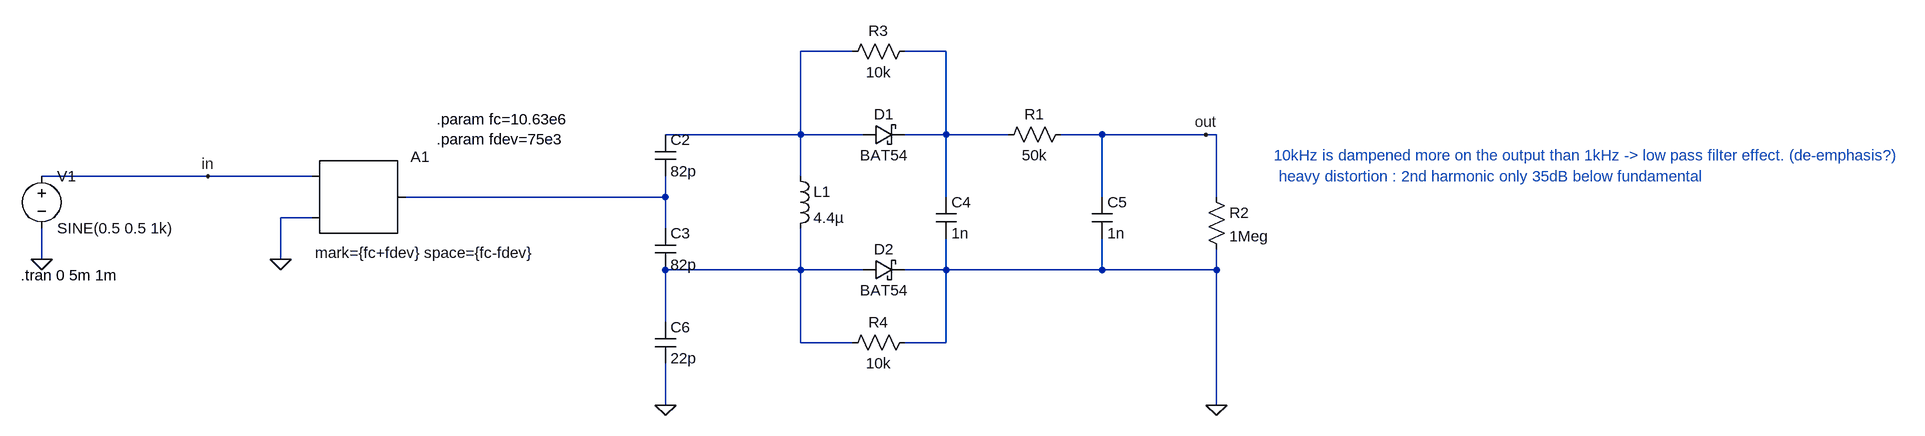
[diagram p0: schematic Weiss_discriminator_2011.asc]
Weiss_discriminator_2011.asc, the LTspice schematic file:
Version 4
SHEET 1 2636 680
WIRE 928 -96 848 -96
WIRE 1072 -96 1008 -96
WIRE 848 32 848 -96
WIRE 848 32 640 32
WIRE 944 32 848 32
WIRE 1072 32 1072 -96
WIRE 1072 32 1008 32
WIRE 1168 32 1072 32
WIRE 1312 32 1248 32
WIRE 1472 32 1312 32
WIRE 1488 32 1472 32
WIRE -64 96 -320 96
WIRE 96 96 -64 96
WIRE 848 96 848 32
WIRE 640 128 640 96
WIRE 640 128 240 128
WIRE 1072 128 1072 32
WIRE 1312 128 1312 32
WIRE 1488 128 1488 32
WIRE 96 160 48 160
WIRE 640 176 640 128
WIRE -320 224 -320 176
WIRE 48 224 48 160
WIRE 848 240 848 176
WIRE 848 240 640 240
WIRE 944 240 848 240
WIRE 1072 240 1072 192
WIRE 1072 240 1008 240
WIRE 1312 240 1312 192
WIRE 1312 240 1072 240
WIRE 1488 240 1488 208
WIRE 1488 240 1312 240
WIRE 640 320 640 240
WIRE 848 352 848 240
WIRE 928 352 848 352
WIRE 1072 352 1072 240
WIRE 1072 352 1008 352
WIRE 640 448 640 384
WIRE 1488 448 1488 240
FLAG 48 224 0
FLAG -320 224 0
FLAG 640 448 0
FLAG 1488 448 0
FLAG 1472 32 out
FLAG -64 96 in
SYMBOL SpecialFunctions\\modulate 96 96 R0
WINDOW 3 5 118 Left 2
SYMATTR Value mark={fc+fdev} space={fc-fdev}
SYMATTR InstName A1
SYMBOL voltage -320 80 R0
WINDOW 123 0 0 Left 0
WINDOW 39 0 0 Left 0
SYMATTR InstName V1
SYMATTR Value SINE(0.5 0.5 1k)
SYMBOL ind 832 80 R0
SYMATTR InstName L1
SYMATTR Value 4.4µ
SYMBOL cap 624 32 R0
SYMATTR InstName C2
SYMATTR Value 82p
SYMBOL cap 624 176 R0
SYMATTR InstName C3
SYMATTR Value 82p
SYMBOL schottky 944 48 R270
WINDOW 0 32 32 VTop 2
WINDOW 3 0 32 VBottom 2
SYMATTR InstName D1
SYMATTR Value BAT54
SYMATTR Description Diode
SYMATTR Type diode
SYMBOL schottky 944 256 R270
WINDOW 0 32 32 VTop 2
WINDOW 3 0 32 VBottom 2
SYMATTR InstName D2
SYMATTR Value BAT54
SYMATTR Description Diode
SYMATTR Type diode
SYMBOL cap 1056 128 R0
SYMATTR InstName C4
SYMATTR Value 1n
SYMBOL res 1264 16 R90
WINDOW 0 0 56 VBottom 2
WINDOW 3 32 56 VTop 2
SYMATTR InstName R1
SYMATTR Value 50k
SYMBOL cap 1296 128 R0
SYMATTR InstName C5
SYMATTR Value 1n
SYMBOL res 1472 112 R0
SYMATTR InstName R2
SYMATTR Value 1Meg
SYMBOL cap 624 320 R0
SYMATTR InstName C6
SYMATTR Value 22p
SYMBOL res 1024 -112 R90
WINDOW 0 0 56 VBottom 2
WINDOW 3 32 56 VTop 2
SYMATTR InstName R3
SYMATTR Value 10k
SYMBOL res 1024 336 R90
WINDOW 0 0 56 VBottom 2
WINDOW 3 32 56 VTop 2
SYMATTR InstName R4
SYMATTR Value 10k
TEXT -352 248 Left 2 !.tran 0 5m 1m
TEXT 288 8 Left 2 !.param fc=10.63e6\n.param fdev=75e3
TEXT 1576 64 Left 2 ;10kHz is dampened more on the output than 1kHz -> low pass filter effect. (de-emphasis?)
TEXT 1584 96 Left 2 ;heavy distortion : 2nd harmonic only 35dB below fundamental

The netlist it stands for:
* Weiss_discriminator_2011.asc
A1 in 0 0 0 0 0 N003 0 MODULATOR mark={fc+fdev} space={fc-fdev}
V1 in 0 SINE(0.5 0.5 1k)
L1 N001 N004 4.4µ
C2 N001 N003 82p
C3 N003 N004 82p
D1 N001 N002 BAT54
D2 N004 0 BAT54
C4 N002 0 1n
R1 out N002 50k
C5 out 0 1n
R2 out 0 1Meg
C6 N004 0 22p
R3 N002 N001 10k
R4 0 N004 10k
.model D D
.lib standard.dio
.tran 0 5m 1m
.param fc=10.63e6
.param fdev=75e3
* 10kHz is dampened more on the output than 1kHz -> low pass filter effect. (de-emphasis?)
* heavy distortion : 2nd harmonic only 35dB below fundamental
.backanno
.end